# EAGLE schematic v1 (EAGLE 7.3.0)
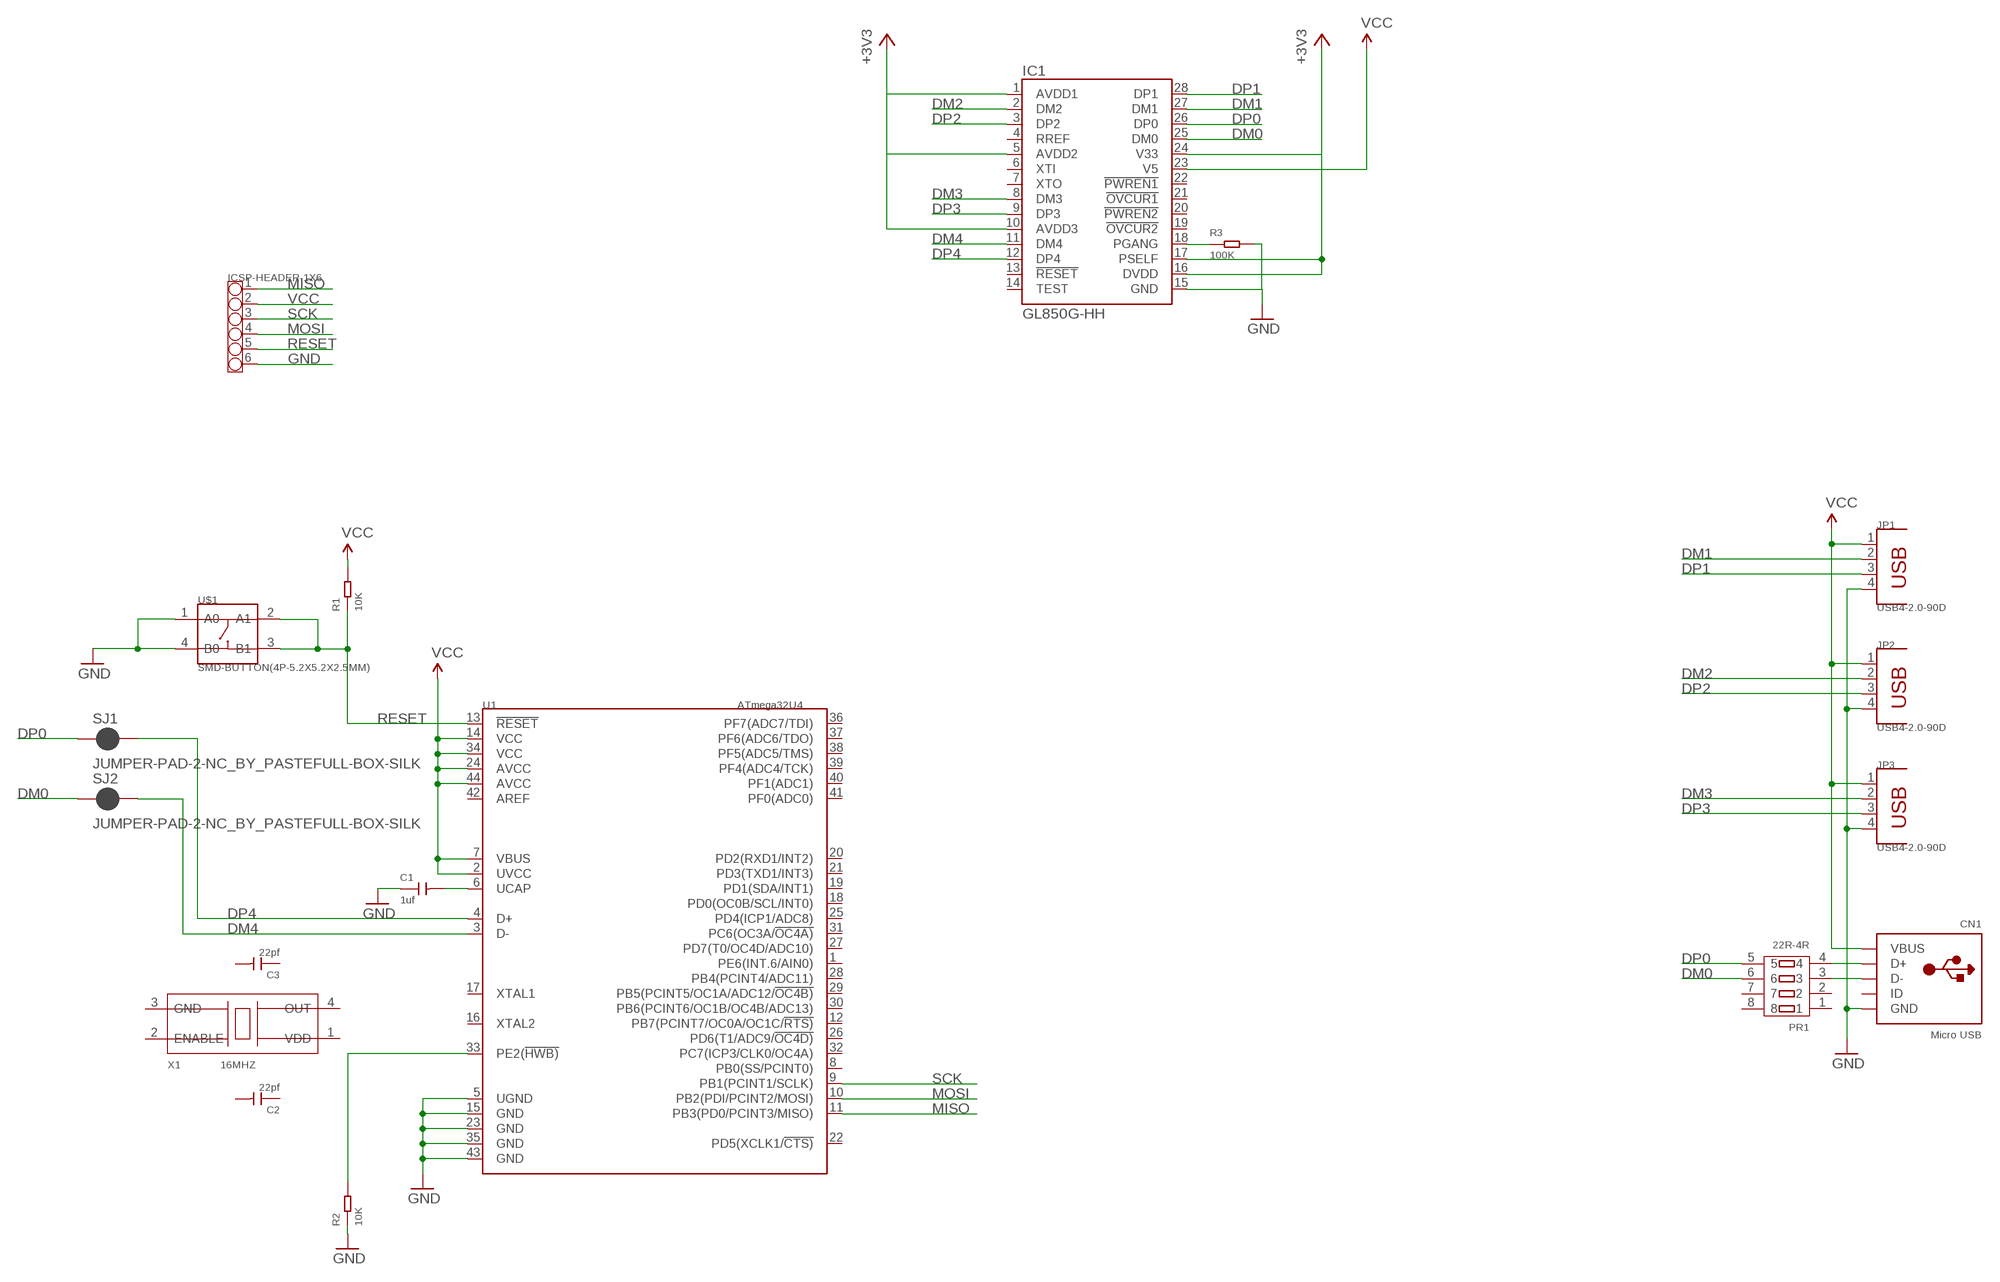
[diagram p0: schematic, sheet 1]

## Parts
C1  1uf  CERAMIC-1UF-25V-10%-X7R(0603)  [C0603]
C2  22pf  CERAMIC-22PF-50V-5%-NPO(0402)  [C0402]
C3  22pf  CERAMIC-22PF-50V-5%-NPO(0402)  [C0402]
CN1  Micro USB  USBMINIB  [USB-MINIB]
IC1  GL850G-HH  [SSOP28]
ICSP-HEADER-1X6  CONNECTOR-HEADER-6P-3460650P1  [1X6P-2.54-2.54-11.6-3.0-BLACK-MALE]
JP1  USB4-2.0-90D  DIP-USB-A-TYPE-FMAL(4+2P-2.0-90D)  [USB4+2P-2.0-90D]
JP2  USB4-2.0-90D  DIP-USB-A-TYPE-FMAL(4+2P-2.0-90D)  [USB4+2P-2.0-90D]
JP3  USB4-2.0-90D  DIP-USB-A-TYPE-FMAL(4+2P-2.0-90D)  [USB4+2P-2.0-90D]
PR1  22R-4R  SMD-RES-ARRAY-22R-4R(1206-8)  [RA1206-8]
R1  10K  SMD-RES-10K-1%-1/10W(0603)  [R0603]
R2  10K  SMD-RES-10K-1%-1/10W(0603)  [R0603]
R3  100K  SMD-RES-100K-1%-1/8W(0805)  [R0805]
SJ1  JUMPER-PAD-2-NC_BY_PASTEFULL-BOX-SILK  [PAD-JUMPER-2-NC_BY_PASTE_YES_SILK_FULL_BOX]
SJ2  JUMPER-PAD-2-NC_BY_PASTEFULL-BOX-SILK  [PAD-JUMPER-2-NC_BY_PASTE_YES_SILK_FULL_BOX]
U1  ATmega32U4  MCU-ATMEGA32U4-310010010  [TQFP-44]
U$1  SMD-BUTTON(4P-5.2X5.2X2.5MM)  [SW4-SMD-5.2X5.2X2.5MM]
X1  16MHZ  SMD-CRYSTAL-16MHZ-9PF-10PPM-60R(4P-3.2X2.5MM)  [X4-SMD-3.2X2.5X0.7MM]

## Nets
+3V3: IC1.1(AVDD1) IC1.5(AVDD2) IC1.10(AVDD3) IC1.16(DVDD) IC1.17(PSELF) IC1.24(V33)
DM0: IC1.25(DM0) PR1.6 SJ2.1
DM1: IC1.27(DM1) JP1.2
DM2: IC1.2(DM2) JP2.2
DM3: IC1.8(DM3) JP3.2
DM4: IC1.11(DM4) SJ2.2 U1.3(D-)
DP0: IC1.26(DP0) PR1.5 SJ1.1
DP1: IC1.28(DP1) JP1.3
DP2: IC1.3(DP2) JP2.3
DP3: IC1.9(DP3) JP3.3
DP4: IC1.12(DP4) SJ1.2 U1.4(D+)
GND: C1.1 CN1.GND IC1.15(GND) ICSP-HEADER-1X6.6 JP1.4 JP2.4 JP3.4 R2.1 R3.2 U1.5(UGND) U1.15(GND) U1.23(GND) U1.35(GND) U1.43(GND) U$1.1(A0) U$1.4(B0)
MISO: ICSP-HEADER-1X6.1 U1.11(PB3(PD0/PCINT3/MISO))
MOSI: ICSP-HEADER-1X6.4 U1.10(PB2(PDI/PCINT2/MOSI))
N$1: C1.2 U1.6(UCAP)
N$2: IC1.18(PGANG) R3.1
N$4: CN1.D+ PR1.4
N$5: CN1.D- PR1.3
N$6: R2.2 U1.33(PE2(!HWB))
RESET: ICSP-HEADER-1X6.5 R1.1 U1.13(!RESET) U$1.2(A1) U$1.3(B1)
SCK: ICSP-HEADER-1X6.3 U1.9(PB1(PCINT1/SCLK))
VCC: CN1.VBUS IC1.23(V5) ICSP-HEADER-1X6.2 JP1.1 JP2.1 JP3.1 R1.2 U1.2(UVCC) U1.7(VBUS) U1.14(VCC) U1.24(AVCC) U1.34(VCC) U1.44(AVCC)
Unconnected: C2.1 C2.2 C3.1 C3.2 CN1.ID IC1.4(RREF) IC1.6(XTI) IC1.7(XTO) IC1.13(!RESET) IC1.14(TEST) IC1.19(!OVCUR2) IC1.20(!PWREN2) IC1.21(!OVCUR1) IC1.22(!PWREN1) JP1.SG1(GND) JP1.SG2(GND) JP2.SG1(GND) JP2.SG2(GND) JP3.SG1(GND) JP3.SG2(GND) PR1.1 PR1.2 PR1.7 PR1.8 U1.1(PE6(INT.6/AIN0)) U1.8(PB0(SS/PCINT0)) U1.12(PB7(PCINT7/OC0A/OC1C/!RTS)) U1.16(XTAL2) U1.17(XTAL1) U1.18(PD0(OC0B/SCL/INT0)) U1.19(PD1(SDA/INT1)) U1.20(PD2(RXD1/INT2)) U1.21(PD3(TXD1/INT3)) U1.22(PD5(XCLK1/!CTS)) U1.25(PD4(ICP1/ADC8)) U1.26(PD6(T1/ADC9/!OC4D)) U1.27(PD7(T0/OC4D/ADC10)) U1.28(PB4(PCINT4/ADC11)) U1.29(PB5(PCINT5/OC1A/ADC12/!OC4B)) U1.30(PB6(PCINT6/OC1B/OC4B/ADC13)) U1.31(PC6(OC3A/!OC4A)) U1.32(PC7(ICP3/CLK0/OC4A)) U1.36(PF7(ADC7/TDI)) U1.37(PF6(ADC6/TDO)) U1.38(PF5(ADC5/TMS)) U1.39(PF4(ADC4/TCK)) U1.40(PF1(ADC1)) U1.41(PF0(ADC0)) U1.42(AREF) X1.1(VDD) X1.2(ENABLE) X1.3(GND) X1.4(OUT)

## Library data of the parts
C1 = Seeed-OPL-Capacitor:CERAMIC-1UF-25V-10%-X7R(0603): 302010139; MPN: CC0603KRX7R8BB105
C2 C3 = Seeed-OPL-Capacitor:CERAMIC-22PF-50V-5%-NPO(0402): 302010018; MPN: CC0402JRNPO9BN220
CN1 = adafruit:USB: USB Connectors USBMINIB - Surface Mount Female Mini-B USB Connector 4UConnector: 06564 By microbuilder.eu Thru-hole RA Female Mini-B USB Connector 4UConnector: 18732 By ladyada.net
IC1 = ElevenDroids - ICs:GL850G-*
ICSP-HEADER-1X6 = Connector:CONNECTOR-HEADER-6P
JP1-JP3 = Seeed-OPL-Connector:DIP-USB-A-TYPE-FMAL(4+2P-2.0-90D): 320010007
PR1 = Seeed-OPL-Resistor:SMD-RES-ARRAY-22R-4R(1206-8): 301030014; MPN: YC324-JK-0722RL
R1 R2 = Seeed-OPL-Resistor:SMD-RES-10K-1%-1/10W(0603): 301010299; MPN: RC0603FR-0710KL
R3 = Seeed-OPL-Resistor:SMD-RES-100K-1%-1/8W(0805): 301010396; MPN: RC0805FR-07100KL
SJ1 SJ2 = SparkFun-Passives:JUMPER-PAD-2-NC_BY_PASTE
U1 = IC:MCU-ATMEGA32U4: 8-bit Microcontroller with 16/32K Bytes of ISP Flash and USB Controller
U$1 = Seeed-OPL-Switch:SMD-BUTTON(4P-5.2X5.2X2.5MM)
X1 = Seeed-OPL-crystal-osctllator:SMD-CRYSTAL-16MHZ-9PF-10PPM-60R(4P-3.2X2.5MM): 306010078